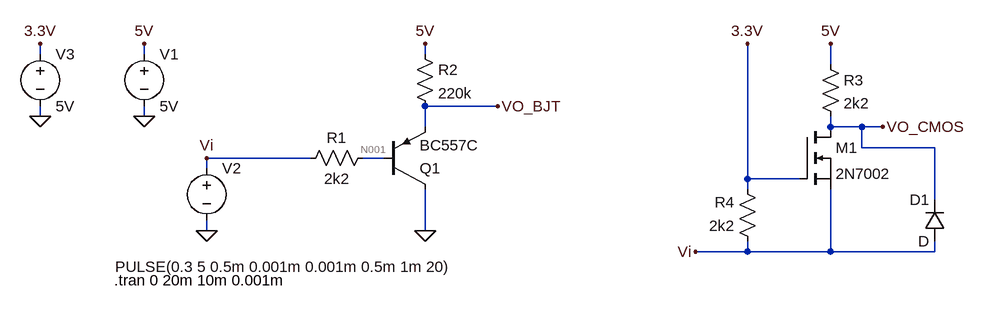
[diagram p0: schematic level_shifter.asc]
level_shifter.asc, the LTspice schematic file:
Version 4
SHEET 1 1064 680
WIRE -368 0 -368 -16
WIRE -208 0 -208 -16
WIRE 224 0 224 -16
WIRE 848 16 848 -16
WIRE 336 80 224 80
WIRE -368 96 -368 80
WIRE -208 96 -208 80
WIRE 224 112 224 80
WIRE 848 112 848 96
WIRE 896 112 848 112
WIRE 928 112 896 112
WIRE 896 144 896 112
WIRE 1008 144 896 144
WIRE 48 160 -112 160
WIRE 160 160 128 160
WIRE -112 176 -112 160
WIRE 720 192 720 -16
WIRE 800 192 720 192
WIRE 720 208 720 192
WIRE 1008 224 1008 144
WIRE -112 272 -112 256
WIRE 224 272 224 208
WIRE 720 304 720 288
WIRE 720 304 640 304
WIRE 848 304 848 208
WIRE 848 304 720 304
WIRE 1008 304 1008 288
WIRE 1008 304 848 304
FLAG 224 272 0
FLAG -208 96 0
FLAG -208 -16 5V
FLAG 224 -16 5V
FLAG -112 272 0
FLAG -112 160 Vi
FLAG 336 80 VO_BJT
FLAG 640 304 Vi
FLAG 720 -16 3.3V
FLAG 928 112 VO_CMOS
FLAG 848 -16 5V
FLAG -368 96 0
FLAG -368 -16 3.3V
SYMBOL res 144 144 R90
WINDOW 0 0 56 VBottom 2
WINDOW 3 32 56 VTop 2
SYMATTR InstName R1
SYMATTR Value 2k2
SYMBOL res 208 -16 R0
SYMATTR InstName R2
SYMATTR Value 220k
SYMBOL pnp 160 208 M180
SYMATTR InstName Q1
SYMATTR Value BC557C
SYMBOL voltage -208 -16 R0
WINDOW 123 0 0 Left 0
WINDOW 39 0 0 Left 0
SYMATTR InstName V1
SYMATTR Value 5V
SYMBOL voltage -112 160 R0
WINDOW 3 -141 167 Left 2
WINDOW 123 0 0 Left 0
WINDOW 39 0 0 Left 0
SYMATTR InstName V2
SYMATTR Value PULSE(0.3 5 0.5m 0.001m 0.001m 0.5m 1m 20)
SYMBOL nmos 800 112 R0
SYMATTR InstName M1
SYMATTR Value 2N7002
SYMBOL res 832 0 R0
SYMATTR InstName R3
SYMATTR Value 2k2
SYMBOL res 736 304 R180
WINDOW 0 36 76 Left 2
WINDOW 3 36 40 Left 2
SYMATTR InstName R4
SYMATTR Value 2k2
SYMBOL diode 1024 288 R180
WINDOW 0 24 64 Left 2
WINDOW 3 24 0 Left 2
SYMATTR InstName D1
SYMBOL voltage -368 -16 R0
WINDOW 123 0 0 Left 0
WINDOW 39 0 0 Left 0
SYMATTR InstName V3
SYMATTR Value 5V
TEXT -254 348 Left 2 !.tran 0 20m 10m 0.001m

The netlist it stands for:
* level_shifter.asc
R1 N001 Vi 2k2
R2 5V VO_BJT 220k
Q1 0 N001 VO_BJT 0 BC557C
V1 5V 0 5V
V2 Vi 0 PULSE(0.3 5 0.5m 0.001m 0.001m 0.5m 1m 20)
M1 VO_CMOS 3.3V Vi Vi 2N7002
R3 5V VO_CMOS 2k2
R4 Vi 3.3V 2k2
D1 Vi VO_CMOS D
V3 3.3V 0 5V
.model D D
.lib standard.dio
.model NPN NPN
.model PNP PNP
.lib standard.bjt
.model NMOS NMOS
.model PMOS PMOS
.lib standard.mos
.tran 0 20m 10m 0.001m
.backanno
.end

* Results of the author's LTspice run, read from the files saved beside the schematic
* Operating Point, zero values left out:
*   V(n001) = 300.1 mV
*   V(vi) = 300 mV
*   V(5v) = 5 V
*   V(vo_bjt) = 813.4 mV
*   V(vo_cmos) = 304.8 mV
*   V(3.3v) = 5 V
*   Ic(Q1) = -18.99 µA
*   Ib(Q1) = -44.43 nA
*   Ie(Q1) = 19.03 µA
*   Id(M1) = 2.134 mA
*   Is(M1) = -2.134 mA
*   I(R4) = -2.136 mA
*   I(R3) = 2.134 mA
*   I(R2) = 19.03 µA
*   I(R1) = 44.43 nA
*   I(V3) = -2.136 mA
*   I(V2) = 4.271 mA
*   I(V1) = -2.153 mA
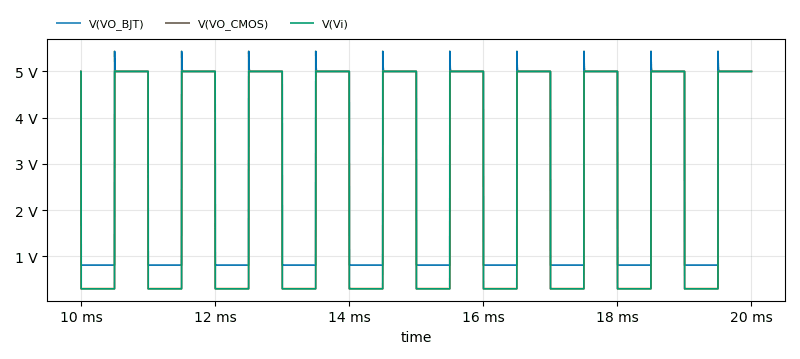
[diagram p1: Transient Analysis of level_shifter.asc, plotted from the saved traces]
* Transient Analysis, 1 run:
*   V(VO_BJT): min 813.4 mV, max 5.437 V, average 2.913 V, rms 3.587 V, last 5 V
*   V(VO_CMOS): min 301.3 mV, max 5 V, average 2.657 V, rms 3.545 V, last 5 V
*   V(Vi): min 300 mV, max 5 V, average 2.655 V, rms 3.544 V, last 5 V